# EAGLE design RFM69_NRF_adapter (EAGLE 8.5.1)
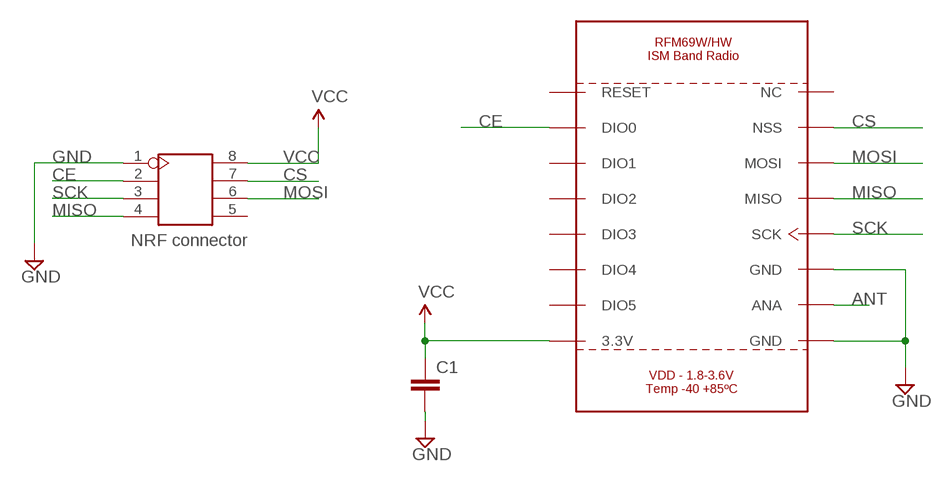
[diagram p0: schematic, sheet 1]

## Parts
C1  C-EUC1206K  [C1206K]
J1  NRF connector  HEADER-2X4P-2.54  [2X4P-2.54]
U$1  RFM69W/HW-  [RFM69W/HW]

## Nets
ANT: U$1.P$10(ANA)
CE: J1.2 U$1.P$2(DIO0)
CS: J1.7 U$1.P$15(NSS)
GND: C1.2 J1.1 U$1.P$9(GND) U$1.P$11(GND)
MISO: J1.4 U$1.P$13(MISO)
MOSI: J1.6 U$1.P$14(MOSI)
SCK: J1.3 U$1.P$12(SCK)
VCC: C1.1 J1.8 U$1.P$8(3.3V)
Unconnected: J1.5 U$1.P$1(RESET) U$1.P$3(DIO1) U$1.P$4(DIO2) U$1.P$5(DIO3) U$1.P$6(DIO4) U$1.P$7(DIO5) U$1.P$16(NC)

## Library data of the parts
C1 = rcl:C-EU: CAPACITOR, European symbol; SPICEPREFIX: C
J1 = Seeed-Connector:HEADER-2X4P
U$1 = HopeRF:RFM69W/HW: HopeRF RFM69W / RFM69HW ISM Band Radio Modules The RFM69W/HW are transceiver modules capable of operation over a wide frequency range, including the 315, 433, 868 and 915MHz license-free ISM (Industry Scientific and Medical) frequency bands. All major RF communication parameters are programmable and most of them can be dynamically set. The RFM69W/HW offer the unique advantage of programmable narrow-band and wide- band communication modes The RFM69W/HW are optimized for low power consumption while offering high RF output power and channelized operation. Compliance ETSI and FCC regulations. Features +13 dBm (+20 dBm - 100 mW for HW variant) Power Output Capability High Sensitivity: down to -120 dBm at 1.2 kbps High Selectivity: 16-tap FIR Channel Filter Bullet-proof front end: IIP3 = -18 dBm, IIP2 = +35 dBm,80 dB Blocking Immunity, no Image Frequency response Low current: Rx = 16 mA, 100nA register retention Programmable Pout: -18 to +13 dBm (+20 dBm for the HW variant) in 1dB steps Constant RF performance over voltage range of module FSK Bit rates up to 300 kb/s Fully integrated synthesizer with a resolution of 61 Hz FSK, GFSK, MSK, GMSK and OOK modulations Built-in Bit Synchronizer performing Clock Recovery Incoming Sync Word Recognition 115 dB+ Dynamic Range RSSI Automatic RF Sense with ultra-fast AFC Packet engine with CRC-16, AES-128, 66-byte FIFO Built-in temperature sensor Module Size:19.7X16mm Purchase at: Anarduino.com <http://www.anarduino.com/?cid=1> RS Components <http://au.rs-online.com/web/c/computing-peripherals/wireless-components-modules/telemetry-modules/?searchTerm=RFM69W&h=s&sra=oss&redirect-relevancy-data=636F3D3226696E3D4931384E4B6E6F776E41734D504E266C753D656E266D6D3D6D61746368616C6C7061727469616C26706D3D5E5B5C707B4C7D5C707B4E647D2D2C2F255C2E5D2B2426706F3D313326736E3D592673743D4D414E5F504152545F4E554D4245522677633D424F5448267573743D52464D363957267374613D52464D36395726>

## Net classes
0 default: clearance 0.254 mm
1 power: width 0.203 mm, drill 0.305 mm, clearance 0.152 mm

## Board
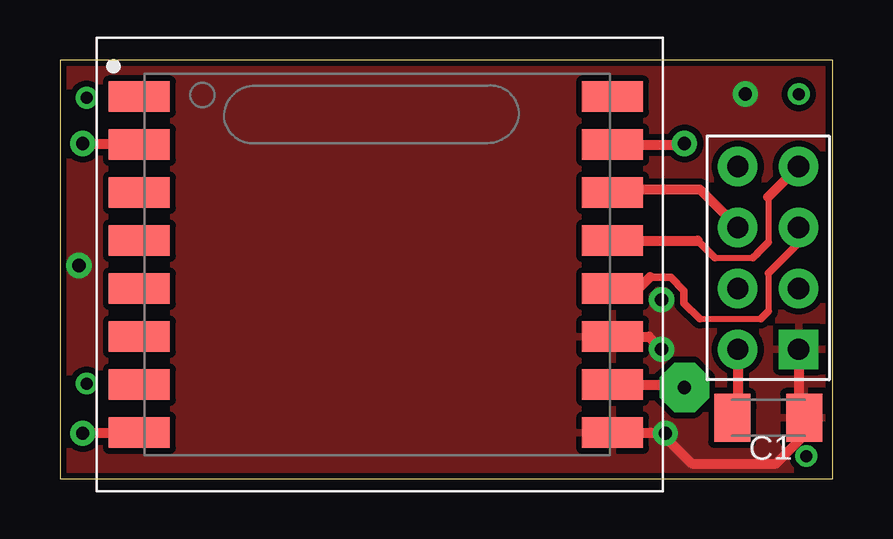
[diagram p1: board, top side]
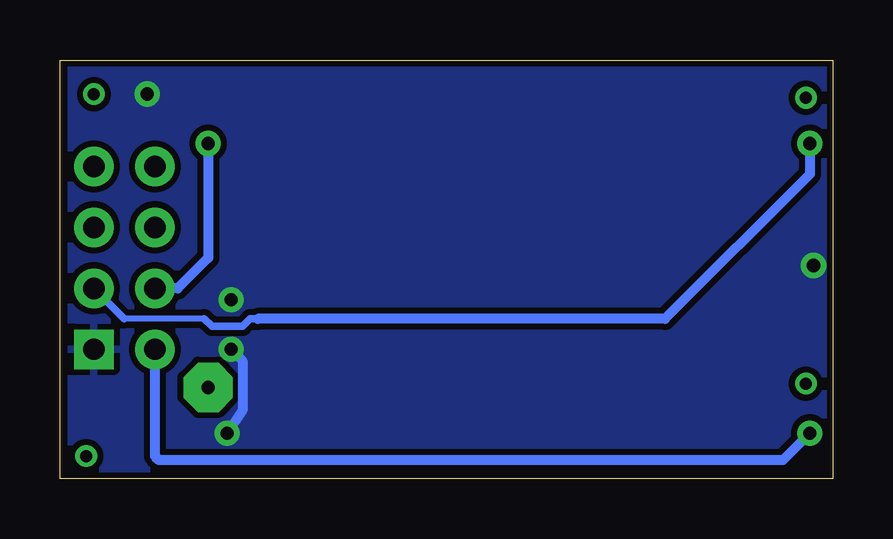
[diagram p2: board, bottom side, seen from below]

Size 32.21 x 17.45 mm. Coordinates in mm from the lower left corner, seen from the top.
Outline: 0,0 32.21,0 32.21,17.45 0,17.45 0,0
Copper layers (1*16): Top 0.035mm / dielectric 1.5mm / Bottom 0.035mm
Design rules "default *": minimum track width 6mil, minimum drill 0.35mm, track to track 6mil, track to pad 6mil, pad to pad 6mil, via to via 6mil, smd to smd 6mil, copper to edge 10mil, drill to drill 6mil, minimum pad ring 10mil, minimum via ring 8mil, stop-mask expansion 4mil, vias tented up to drill 0mil, thermal gap 10mil

### Footprints (pad centres in the part's own frame; a part is rotated, then mirrored left to right if it is on the bottom)
C1206K = smd 1.5 x 2: 1 -1.5,0; 2 1.5,0
2X4P-2.54 = drill 0.889 pad 1.651 square: 1 -1.27,3.81 | drill 0.889 pad 1.651: 2 -1.27,1.27; 3 -1.27,-1.27; 4 -1.27,-3.81; 5 1.27,-3.81; 6 1.27,-1.27; 7 1.27,1.27; 8 1.27,3.81
RFM69W/HW = smd 2.54 x 1.27: P$1 -10.03,7.035; P$2 -10.03,5.035; P$3 -10.03,3.035; P$4 -10.03,1.035; P$5 -10.03,-0.965; P$6 -10.03,-2.965; P$7 -10.03,-4.965; P$8 -10.03,-6.965; P$9 9.7,-6.965; P$10 9.7,-4.965; P$11 9.7,-2.965; P$12 9.7,-0.965; P$13 9.7,1.035; P$14 9.7,3.035; P$15 9.7,5.035; P$16 9.7,7.035

### Placement (x,y rotation side)
C1  29.53,2.54 0 top
J1  29.53,9.21 180 top
U$1  13.34,8.89 0 top

### Tracks (layer width: path | path; a pad name or v marks a point on that pad's centre or on a via)
ANT  (via drill 0.55 pad 2.06)
  Top 0.406: U$1.P$10 25.92,3.92 v26.04,3.81
CE  (via drill 0.55 pad 1.05)
  Top 0.305: 3.26,13.97 U$1.P$2
  Top 0.406: v0.95,13.97 3.26,13.97
  Bottom 0.254: 26.19,6.67 29.53,6.67
  Bottom 0.305: J1.2 29.53,6.67 | 23.97,6.67 24.29,6.67 24.61,6.35 25.88,6.35 26.19,6.67
  Bottom 0.406: v0.95,13.97 0.95,12.7 6.99,6.67 23.97,6.67
CS  (via drill 0.55 pad 1.05)
  Top 0.305: 23.08,13.97 U$1.P$15
  Top 0.406: U$1.P$15 25.99,13.93 v26.04,13.97
  Bottom 0.406: v26.04,13.97 26.04,9.21 27.3,7.94 J1.7
GND  (via drill 0.55 pad 1.05)
  Top 0.406: J1.1 30.8,3.17 | U$1.P$11 24.55,5.92 v25.08,5.4 | U$1.P$9 24.63,1.92 v25.24,1.91 25.08,1.91 26.35,0.63 29.84,0.63 31.03,1.82 C1.2
  Bottom 0.406: v25.24,1.91 24.61,2.86 24.61,4.92 v25.08,5.4
  other vias: 25.08,7.46 28.58,16.03 0.79,8.89
  pour Bottom: 0.32,17.14 31.75,17.14 31.75,0.32 0.32,0.32
  pour Top: 31.75,17.14 31.75,0.32 0.32,0.32 0.32,17.14
MISO
  Top 0.254: 27.3,9.21 28.89,9.21 | 29.53,11.75 29.53,9.85
  Top 0.305: 26.59,9.93 27.3,9.21 | 28.89,9.21 29.07,9.39 29.07,9.4 29.53,9.85
  Top 0.406: U$1.P$13 26.59,9.93 | J1.4 29.53,11.75
MOSI
  Top 0.406: U$1.P$14 23.18,12.07 26.67,12.07 J1.6
N$1  (via drill 0.5)
  other vias: 1.11,15.88
N$2  (via drill 0.5)
  other vias: 30.8,16.03
N$3  (via drill 0.5)
  other vias: 31.12,0.95
N$4  (via drill 0.5)
  other vias: 1.11,3.97
SCK
  Top 0.254: 26.67,6.67 29.21,6.67 | 29.53,8.57 29.53,6.99
  Top 0.305: 29.53,6.99 29.21,6.67 | 29.53,8.57 30.8,9.84 J1.3 | 26.67,6.67 26.01,7.32 26.01,7.85 25.46,8.4 24.59,8.4
  Top 0.406: U$1.P$12 24.12,7.92 24.59,8.4
VCC  (via drill 0.55 pad 1.05)
  Top 0.406: v0.95,1.91 0.97,1.92 U$1.P$8 | C1.1 28.1,2.61 28.17,2.61 28.58,3.02 28.26,3.33 J1.8
  Bottom 0.406: v0.95,1.91 2.06,0.79 28.1,0.79 28.26,0.95 J1.8